# Altium schematic sheet 02_boost5v.SchDoc
size A; SheetNumber: 10; SheetTotal: 17
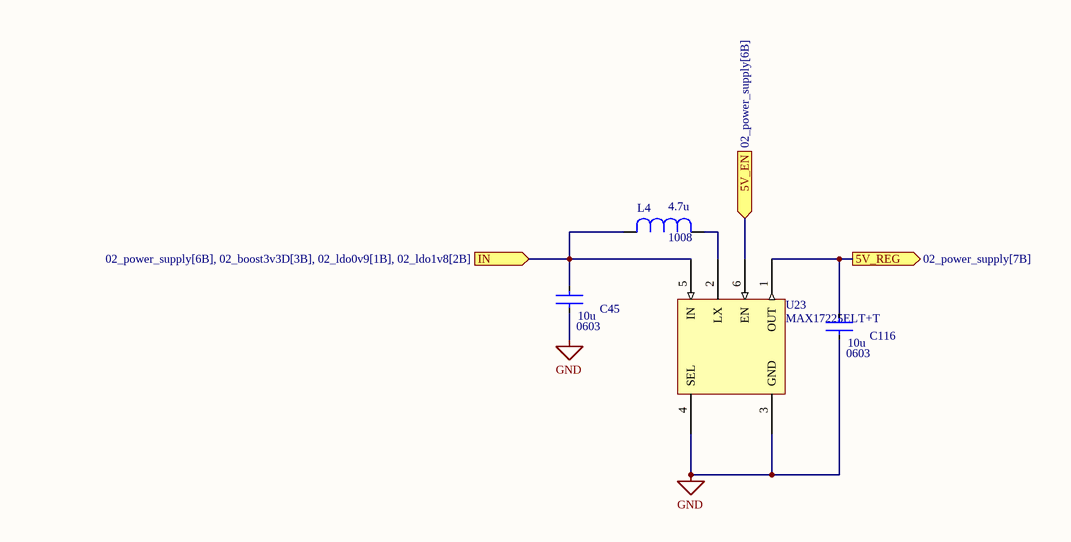
[diagram p0: 02_boost5v.SchDoc]

## Parts
C45  C1608X5R1A106K080AC  [CAPTDK0603]  (value not drawn)
C116  C1608X5R1A106K080AC  [CAPTDK0603]  (value not drawn)
L4  1269AS-H-4R7M=P2  [INDMURT1008]  (value not drawn)
U23  MAX17225ELT+T  [MAX17222ELT+T]

## Ports
5V_EN (in, see 02_power_supply[6B]), 5V_REG (out, see 02_power_supply[7B]), IN (in, see 02_power_supply[6B], 02_boost3v3D[3B], 02_ldo0v9[1B], 02_ldo1v8[2B])

## Nets
GND: C45.2 C116.2 U23.3(GND) U23.4(SEL)
5V_EN: U23.6(EN) ; port 5V_EN
5V_REG: C116.1 U23.1(OUT) ; port 5V_REG
IN: C45.1 L4.2 U23.5(IN) ; port IN
NetL4_1: L4.1 U23.2(LX)

## Notes on the sheet
- (in symbol 1269AS-H-4R7M=P2) 4.7u; 1008
- (in symbol C1608X5R1A106K080AC) 10u; 0603

## Library data of the parts
C45 C116 = C1608X5R1A106K080AC: CAP CER 10UF 10V X5R 0603; Supplier 1: Digi-Key; Supplier Part Number 1: 445-C1608X5R1A106K080ACCT-ND
L4 = 1269AS-H-4R7M=P2: FIXED IND 4.7UH 1.3A 300MOHM SMD; MF: Murata Electronics; Check_prices: https://www.snapeda.com/parts/1269AS-H-4R7M=P2/Murata%20Electronics%20North%20America/view-part/1502620/?ref=eda; Digi-Key_Part_Number: 490-10577-1-ND; SnapEDA_Link: https://www.snapeda.com/parts/1269AS-H-4R7M=P2/Murata%20Electronics%20North%20America/view-part/1502620/?ref=snap; Value: *; MP: 1269AS-H-4R7M=P2; Package: 2520 Murata; Purchase-URL: https://pricing.snapeda.com/search/part/1269AS-H-4R7M=P2/?ref=eda; Supplier 1: Digi-Key; Supplier Part Number 1: 490-10577-1-ND
U23 = MAX17225ELT+T: IC REG 0.9V TO 5V 1A 6UDFN; Mfr_Name: Maxim Integrated Products; Copyright: Copyright (C) 2022 Ultra Librarian. All rights reserved.; Manufacturer_Part_Number: MAX17225ELT+T; Digi-Key_Part_Number_1: MAX17225ELT+TTR-ND; Digi-Key_Part_Number_2: MAX17225ELT+TCT-ND; Digi-Key_Part_Number_3: MAX17225ELT+TDKR-ND; RefDes: RefDes; Type: DEV; Supplier 1: Mouser; Supplier Part Number 1: 700-MAX17225ELT+T